# EAGLE design power (EAGLE 6.4)
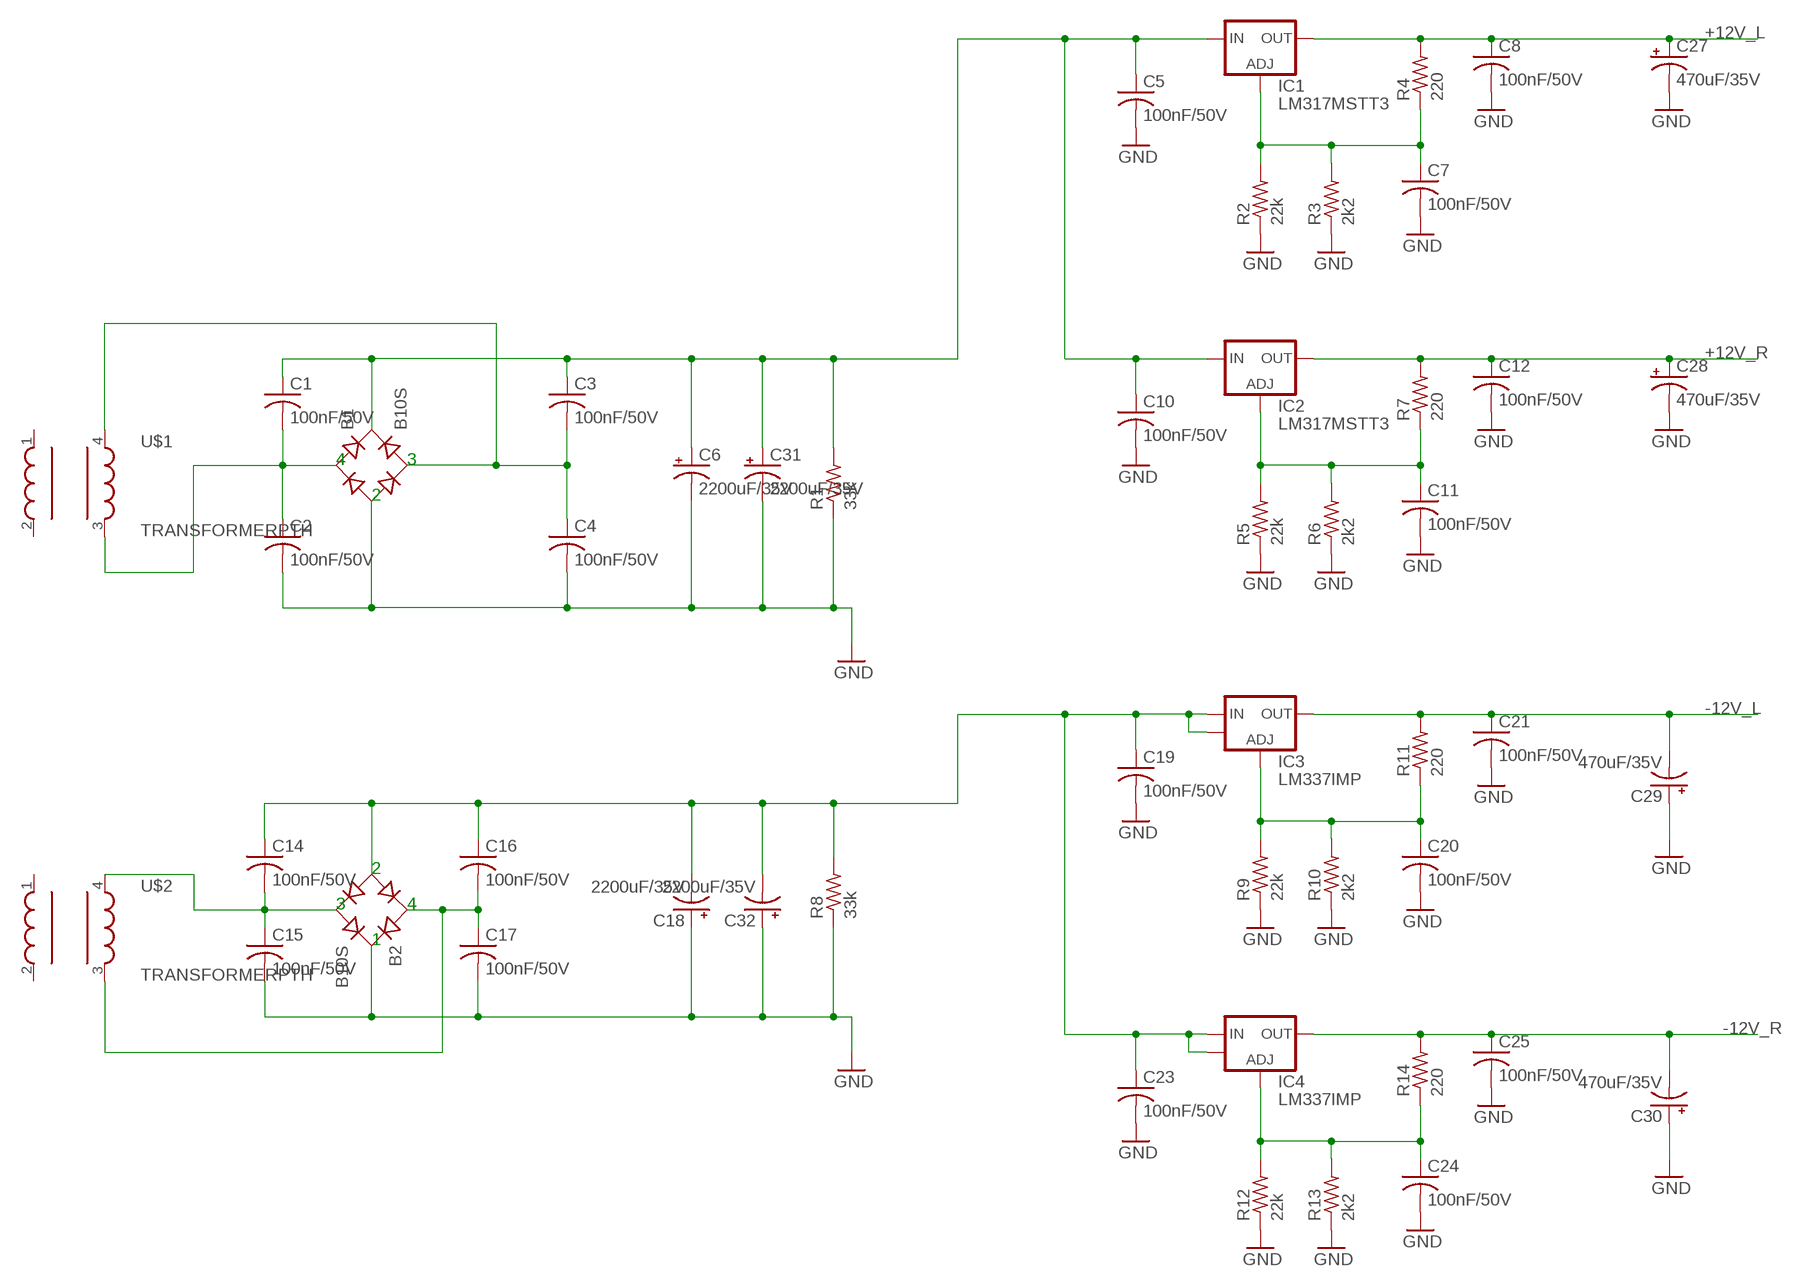
[diagram p0: schematic, sheet 1]

## Parts
B1  B10S  [MBS]
B2  B10S  [MBS]
C1  100nF/50V  C-USC0805  [C0805]
C2  100nF/50V  C-USC0805  [C0805]
C3  100nF/50V  C-USC0805  [C0805]
C4  100nF/50V  C-USC0805  [C0805]
C5  100nF/50V  C-USC0805  [C0805]
C6  2200uF/35V  CPOL-USE5-13  [E5-13]
C7  100nF/50V  C-USC0805  [C0805]
C8  100nF/50V  C-USC0805  [C0805]
C10  100nF/50V  C-USC0805  [C0805]
C11  100nF/50V  C-USC0805  [C0805]
C12  100nF/50V  C-USC0805  [C0805]
C14  100nF/50V  C-USC0805  [C0805]
C15  100nF/50V  C-USC0805  [C0805]
C16  100nF/50V  C-USC0805  [C0805]
C17  100nF/50V  C-USC0805  [C0805]
C18  2200uF/35V  CPOL-USE5-13  [E5-13]
C19  100nF/50V  C-USC0805  [C0805]
C20  100nF/50V  C-USC0805  [C0805]
C21  100nF/50V  C-USC0805  [C0805]
C23  100nF/50V  C-USC0805  [C0805]
C24  100nF/50V  C-USC0805  [C0805]
C25  100nF/50V  C-USC0805  [C0805]
C27  470uF/35V  CPOL-USE5-13  [E5-13]
C28  470uF/35V  CPOL-USE5-13  [E5-13]
C29  470uF/35V  CPOL-USE5-13  [E5-13]
C30  470uF/35V  CPOL-USE5-13  [E5-13]
C31  2200uF/35V  CPOL-USE5-13  [E5-13]
C32  2200uF/35V  CPOL-USE5-13  [E5-13]
IC1  LM317MSTT3  [SOT223]
IC2  LM317MSTT3  [SOT223]
IC3  LM337IMP  [SOT-223]
IC4  LM337IMP  [SOT-223]
R1  33k  R-US_M0805  [M0805]
R2  22k  R-US_M0805  [M0805]
R3  2k2  R-US_M0805  [M0805]
R4  220  R-US_M0805  [M0805]
R5  22k  R-US_M0805  [M0805]
R6  2k2  R-US_M0805  [M0805]
R7  220  R-US_M0805  [M0805]
R8  33k  R-US_M0805  [M0805]
R9  22k  R-US_M0805  [M0805]
R10  2k2  R-US_M0805  [M0805]
R11  220  R-US_M0805  [M0805]
R12  22k  R-US_M0805  [M0805]
R13  2k2  R-US_M0805  [M0805]
R14  220  R-US_M0805  [M0805]
U$1  TRANSFORMERPTH  [TRANSFORMER]
U$2  TRANSFORMERPTH  [TRANSFORMER]

## Nets
+12V_L: C8.1 C27.+ IC1.4(OUT) R4.2
+12V_R: C12.1 C28.+ IC2.4(OUT) R7.2
+VSS_NOREG: B1.+ C1.1 C3.1 C5.1 C6.+ C10.1 C31.+ IC1.3(IN) IC2.3(IN) R1.2
-12V_L: C21.1 C29.- IC3.3(OUT) R11.2
-12V_R: C25.1 C30.- IC4.3(OUT) R14.2
-VSS_NOREG: B2.- C14.1 C16.1 C18.- C19.1 C23.1 C32.- IC3.2(IN) IC3.4 IC4.2(IN) IC4.4 R8.2
GND: B1.- B2.+ C2.2 C4.2 C5.2 C6.- C7.2 C8.2 C10.2 C11.2 C12.2 C15.2 C17.2 C18.+ C19.2 C20.2 C21.2 C23.2 C24.2 C25.2 C27.- C28.- C29.+ C30.+ C31.- C32.+ R1.1 R2.1 R3.1 R5.1 R6.1 R8.1 R9.1 R10.1 R12.1 R13.1
N$1: B1.AC1 C1.2 C2.1 U$1.3
N$2: B1.AC2 C3.2 C4.1 U$1.4
N$4: B2.AC2 C14.2 C15.1 U$2.4
N$7: C7.1 IC1.1(ADJ) R2.2 R3.2 R4.1
N$8: C11.1 IC2.1(ADJ) R5.2 R6.2 R7.1
N$11: B2.AC1 C16.2 C17.1 U$2.3
N$14: C20.1 IC3.1(ADJ) R9.2 R10.2 R11.1
N$17: C24.1 IC4.1(ADJ) R12.2 R13.2 R14.1
Unconnected: U$1.1 U$1.2 U$2.1 U$2.2

## Notes on the sheet
- 4 | 3
- 2
- 2
- 3 | 4
- 1

## Library data of the parts
B1 B2 = rectifier:B*S: Surface Mount Glass Passivated Bridge Rectifiers Source: Comchip Bridge Rectifiers B05S-G_B10S-G.pdf
C1-C5 C7 C8 C10-C12 C14-C17 C19-C21 C23-C25 = rcl:C-US: CAPACITOR, American symbol
C6 C18 C27-C32 = rcl:CPOL-US: POLARIZED CAPACITOR, American symbol
IC1 IC2 = v-reg:LM317?*: 500 mA Adjustable Output Positive Voltage Regulator Source: http://www.onsemi.co.jp .. LM317M-D.PDF
IC3 IC4 = AWJLEagleLib:LM337: LM337 adjustable negative voltage regulator
R1-R14 = rcl:R-US_: RESISTOR, American symbol
U$1 U$2 = SparkFun-PowerIC:TRANSFORMER: Small transformers

## Board
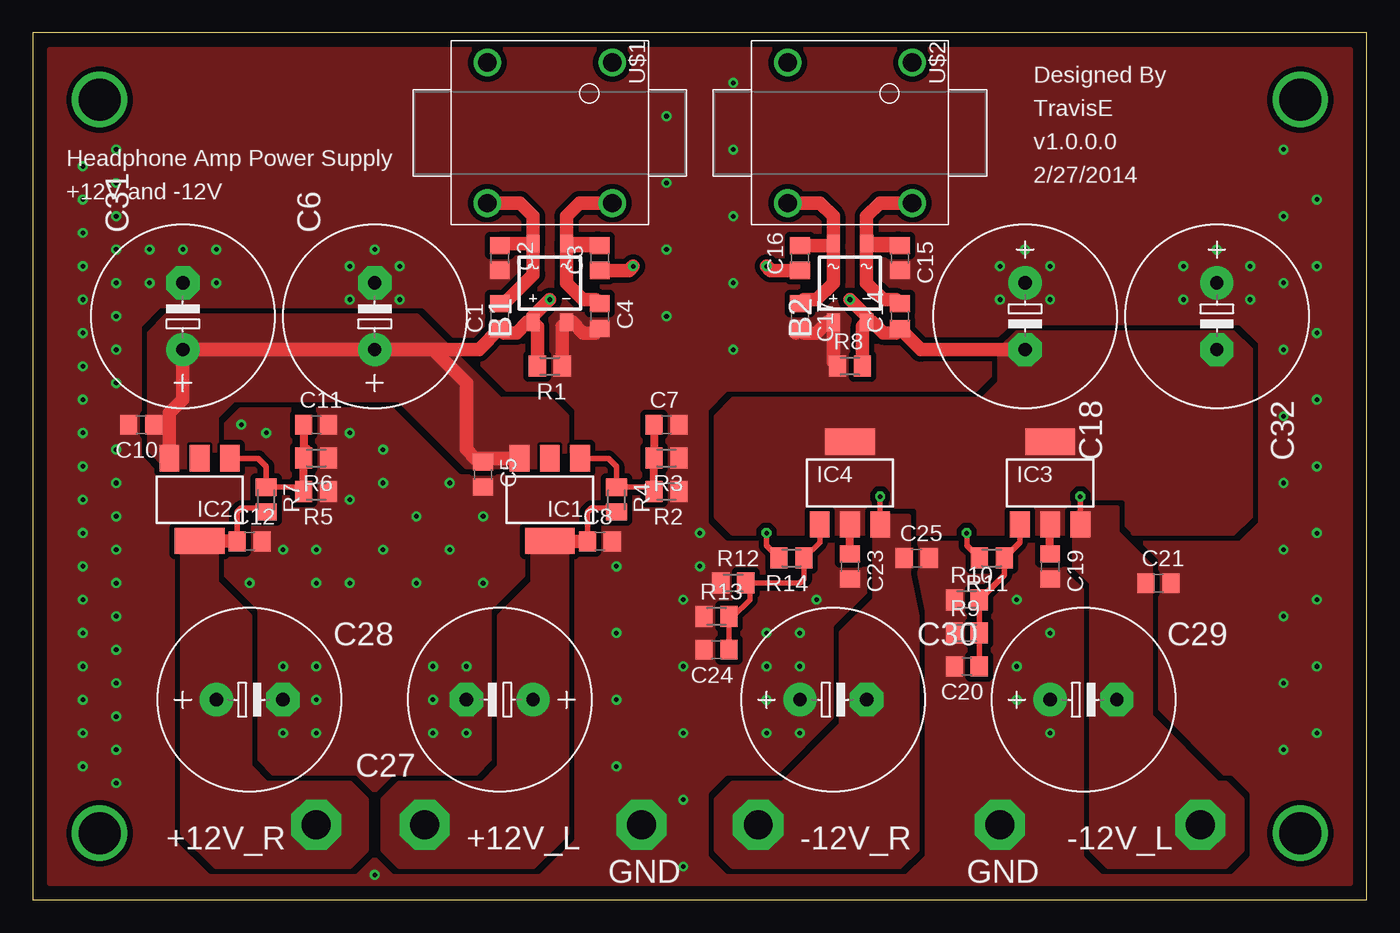
[diagram p1: board, top side]
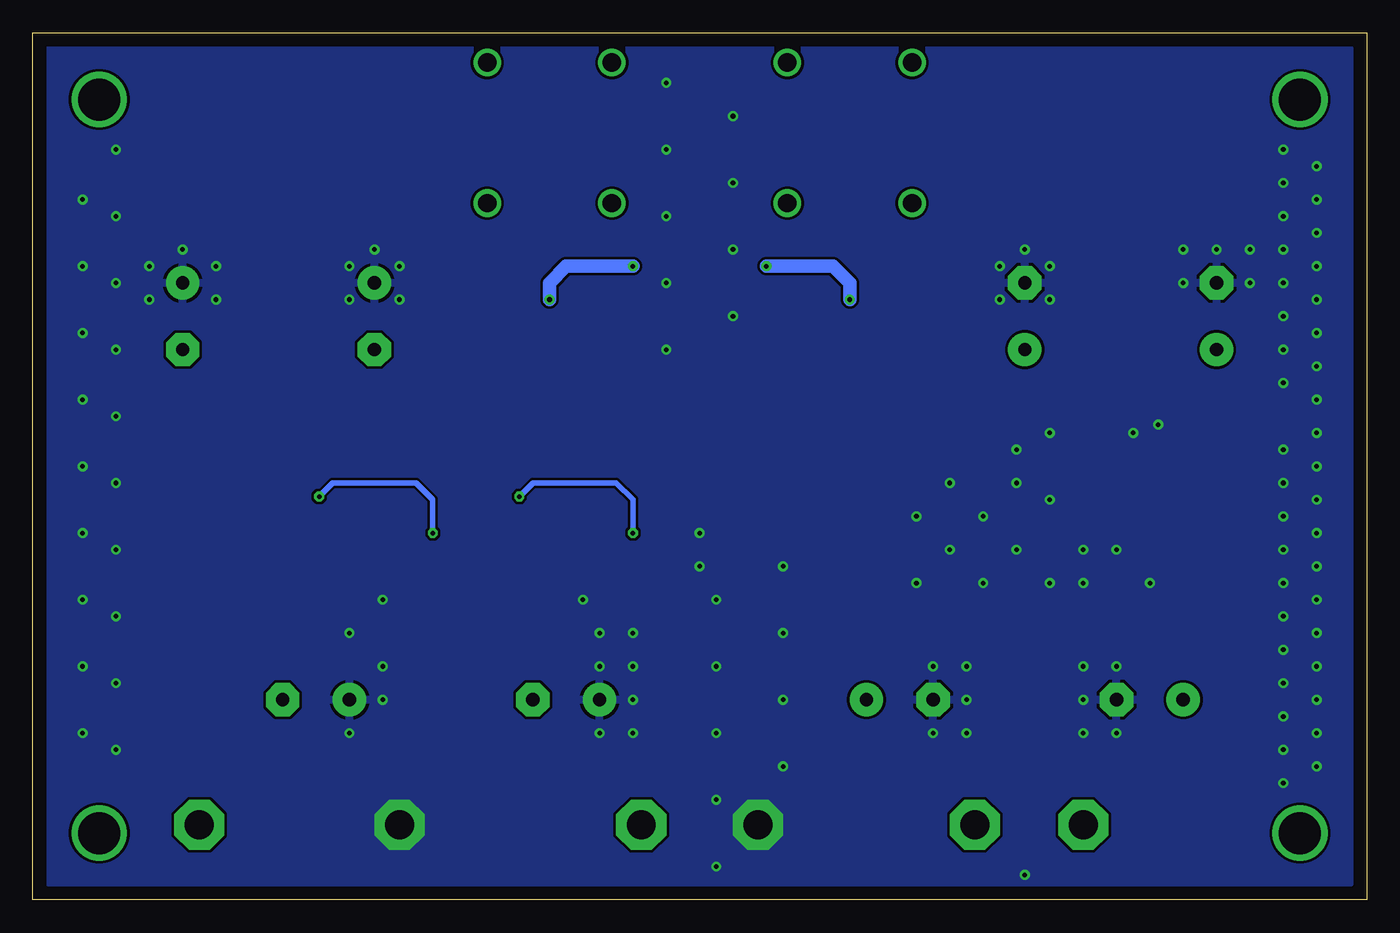
[diagram p2: board, bottom side, seen from below]

Size 101.58 x 66.04 mm. Coordinates in mm from the lower left corner, seen from the top.
Outline: 0,0 101.58,0 101.58,66.04 0,66.04 0,0
Copper layers (1*16): Top 0.035mm / dielectric 1.5mm / Bottom 0.035mm
Design rules "default *": minimum track width 10mil, minimum drill 13mil, track to track 8mil, track to pad 8mil, pad to pad 8mil, via to via 8mil, smd to smd 8mil, copper to edge 40mil, drill to drill 8mil, minimum pad ring 10mil, minimum via ring 8mil, stop-mask expansion 4mil, vias tented up to drill 14mil, thermal gap 10mil

### Footprints (pad centres in the part's own frame; a part is rotated, then mirrored left to right if it is on the bottom)
MBS = smd 1 x 1.3: + -1.27,-3; - 1.27,-3; AC1 -1.27,3; AC2 1.27,3
C0805 = smd 1.3 x 1.5: 1 -0.95,0; 2 0.95,0
E5-13 = drill 1.016 pad 2.54: + -2.54,0 | drill 1.016 pad 2.54 octagon: - 2.54,0
SOT223 = smd 1.5 x 2: 1 -2.3,-3.15; 2 0,-3.15; 3 2.3,-3.15 | smd 3.8 x 2: 4 0,3.15
SOT-223 = smd 1.5 x 2: 1 -2.3,-3.15; 2 0,-3.15; 3 2.3,-3.15 | smd 3.8 x 2: 4 0,3.15
M0805 = smd 1.3 x 1.6: 1 -0.95,0; 2 0.95,0
TRANSFORMER = drill 1.4: 1 -5.35,4.75; 2 -5.35,-4.75; 3 5.35,-4.75; 4 5.35,4.75

### Placement (x,y rotation side)
B1  39.37,46.99 0 top
B2  62.23,46.99 0 top
C1  35.56,44.45 90 top
C2  35.56,48.9 270 top
C3  43.18,48.9 90 top
C4  43.18,44.45 270 top
C5  34.29,32.38 270 top
C6  26.03,44.45 90 top
C7  48.26,36.2 0 top
C8  43.18,27.3 0 top
C10  8.26,36.2 180 top
C11  21.59,36.2 0 top
C12  16.51,27.3 0 top
C14  66.04,44.45 90 top
C15  66.04,48.9 270 top
C16  58.42,48.9 90 top
C17  58.42,44.45 270 top
C18  75.56,44.45 270 top
C19  77.47,25.4 270 top
C20  71.12,17.78 180 top
C21  85.72,24.13 0 top
C23  62.23,25.4 270 top
C24  52.07,19.05 180 top
C25  67.31,26.03 0 top
C27  35.56,15.24 180 top
C28  16.51,15.24 0 top
C29  80.01,15.24 0 top
C30  60.96,15.24 0 top
C31  11.43,44.45 90 top
C32  90.17,44.45 270 top
IC1  39.37,30.48 180 top
IC2  12.7,30.48 180 top
IC3  77.47,31.75 0 top
IC4  62.23,31.75 0 top
R1  39.37,40.64 180 top
R2  48.26,31.12 180 top
R3  48.26,33.65 180 top
R4  44.45,30.48 270 top
R5  21.59,31.12 180 top
R6  21.59,33.65 180 top
R7  17.78,30.48 270 top
R8  62.23,40.64 0 top
R9  71.12,20.32 0 top
R10  71.12,22.86 0 top
R11  73.03,26.03 180 top
R12  53.34,24.13 0 top
R13  52.07,21.59 0 top
R14  57.79,26.03 180 top
U$1  39.37,58.42 270 top
U$2  62.23,58.42 270 top

### Tracks (layer width: path | path; a pad name or v marks a point on that pad's centre or on a via)
+12V_L  (via drill 2.2 pad 3.81)
  Top 0.406: C8.1 42.23,29.53 42.54,29.84 44.13,29.84 R4.2
  Top 1.016: C8.1 39.4,27.3
  other vias: 29.84,5.71
  pour Top (no thermals): 38.1,27.94 38.1,24.13 35.56,21.59 35.56,10.16 34.29,8.89 27.94,8.89 26.67,7.62 26.67,3.81 27.94,2.54 38.1,2.54 40.64,5.08 40.64,27.94
+12V_R  (via drill 2.2 pad 3.81)
  Top 0.406: C12.1 15.56,29.53 15.88,29.84 17.46,29.84 R7.2
  Top 1.016: IC2.4 15.53,27.33 C12.1
  other vias: 21.59,5.71
  pour Top (no thermals): 11.43,27.94 11.43,5.08 13.97,2.54 24.13,2.54 25.4,3.81 25.4,7.62 24.13,8.89 17.78,8.89 16.51,10.16 16.51,21.59 13.97,24.13 13.97,27.94
+VSS_NOREG  (via drill 0.35)
  Top 1.016: B1.+ 37.64,43.99 36.83,43.18 35.88,43.18 C1.1 33.97,41.91 30.48,41.91 | C3.1 45.4,47.95 v45.72,48.26 | B1.+ 38.1,44.45 v39.37,45.72 | R1.2 38.42,43.67 B1.+ | 30.48,41.91 C6.+ C31.+ 11.43,38.1 10.4,37.07 IC2.3 | IC1.3 33.68,33.63 33.02,34.29 33.02,39.37 30.48,41.91
  Bottom 1.016: v39.37,45.72 39.37,46.99 40.64,48.26 v45.72,48.26
  pour Top (no thermals): 29.21,44.45 10.16,44.45 8.89,43.18 8.89,34.29 10.16,33.02 12.7,33.02 13.97,34.29 13.97,36.83 15.24,38.1 27.94,38.1 33.02,33.02 39.37,33.02 40.64,34.29 40.64,36.83 39.37,38.1 35.56,38.1
-12V_L  (via drill 0.35, 2.2 pad 3.81)
  Top 0.406: IC3.3 v79.77,30.72 | R11.2 71.12,26.99 v71.12,27.94
  Bottom 0.406: v79.77,30.72 78.74,31.75 72.39,31.75 71.12,30.48 v71.12,27.94
  other vias: 88.9,5.71
  pour Top (no thermals): 79.38,29.21 79.38,25.4 80.65,24.13 80.65,3.81 81.91,2.54 90.81,2.54 92.07,3.81 92.07,7.62 90.81,8.89 90.17,8.89 85.09,13.97 85.09,25.4 82.55,27.94 82.55,29.84 80.01,29.84
-12V_R  (via drill 0.35, 2.2 pad 3.81)
  Top 0.406: IC4.3 v64.53,30.72 | R14.2 55.88,26.99 v55.88,27.94
  Bottom 0.406: v64.53,30.72 63.5,31.75 57.15,31.75 55.88,30.48 v55.88,27.94
  other vias: 55.24,5.71
  pour Top (no thermals): 64.13,29.21 64.13,22.86 61.6,20.32 61.6,13.33 57.15,8.89 53.34,8.89 52.07,7.62 52.07,3.81 53.34,2.54 66.04,2.54 67.31,3.81 67.31,21.59 66.68,24.76 66.68,29.21
-VSS_NOREG  (via drill 0.35)
  Top 0.61: C23.1 IC4.2 | C19.1 IC3.2
  Top 1.016: C16.1 56.2,47.95 v55.88,48.26 | v62.23,45.72 63.5,44.45 B2.- | B2.- 63.96,43.99 64.77,43.18 65.72,43.18 C14.1 67.63,41.91 C18.- | R8.2 63.18,43.67 B2.-
  Bottom 1.016: v55.88,48.26 60.96,48.26 62.23,46.99 v62.23,45.72
  pour Top (isolate 0.406, rank 5, no thermals): 74.93,43.18 73.66,41.91 73.66,39.37 72.39,38.1 53.34,38.1 52.07,36.83 52.07,29.21 53.34,27.94 85.09,27.94 86.36,29.21 86.36,36.83 85.09,38.1 78.74,38.1 77.47,39.37 77.47,41.91 76.2,43.18
  pour Top (no thermals): 76.2,43.18 91.44,43.18 92.71,41.91 92.71,29.21 91.44,27.94 83.82,27.94 83.82,36.83 77.47,36.83 76.2,38.1
GND  (via drill 0.35, 2.2 pad 3.81)
  Top 1.016: C4.2 42.86,43.18 41.91,43.18 41.1,43.99 B1.- 40.32,43.67 R1.1 | 58.1,43.18 C17.2 58.74,43.18 59.69,43.18 60.5,43.99 B2.+ 60.96,40.96 R8.1
  other vias: 17.78,35.56 15.88,36.2 26.03,1.9 46.35,5.71 73.66,5.71 6.35,57.15 6.35,54.61 3.81,55.88 3.81,53.34 6.35,52.07 3.81,50.8 13.97,46.99 13.97,49.53 11.43,49.53 8.89,49.53 6.35,49.53 6.35,46.99 3.81,48.26 3.81,45.72 8.89,46.99 6.35,44.45 6.35,41.91 6.35,39.37 3.81,43.18 3.81,40.64 3.81,38.1 3.81,35.56 6.35,34.29 6.35,31.75 3.81,33.02 3.81,30.48 6.35,29.21 6.35,26.67 3.81,27.94 3.81,25.4 6.35,24.13 6.35,21.59 3.81,22.86 3.81,20.32 6.35,19.05 3.81,17.78 6.35,16.51 6.35,13.97 3.81,15.24 3.81,12.7 6.35,11.43 3.81,10.16 6.35,8.89 26.03,49.53 27.94,48.26 27.94,45.72 24.13,48.26 24.13,45.72 24.13,35.56 26.67,34.29 26.67,31.75 31.75,31.75 34.29,29.21 34.29,24.13 31.75,26.67 29.21,29.21 29.21,24.13 26.67,26.67 24.13,30.48 24.13,24.13 21.59,24.13 21.59,26.67 19.05,26.67 16.51,24.13 33.02,12.7 30.48,12.7 30.48,15.24 30.48,17.78 33.02,17.78 19.05,12.7 21.59,12.7 21.59,15.24 21.59,17.78 19.05,17.78 49.53,2.54 49.53,7.62 44.45,10.16 49.53,12.7 44.45,15.24 49.53,17.78 55.88,12.7 58.42,12.7 55.88,15.24 55.88,17.78 58.42,17.78 58.42,20.32 59.69,22.86 55.88,20.32 44.45,20.32 49.53,22.86 44.45,25.4 50.8,25.4 50.8,27.94 77.47,12.7 74.93,15.24 74.93,17.78 77.47,20.32 74.93,22.86 95.25,11.43 97.79,12.7 95.25,16.51 97.79,17.78 95.25,21.59 97.79,22.86 97.79,27.94 95.25,26.67 95.25,31.75 97.79,33.02 95.25,36.83 97.79,38.1 95.25,41.91 97.79,43.18 97.79,48.26 95.25,52.07 95.25,46.99 92.71,45.72 87.63,45.72 90.17,49.53 92.71,48.26 87.63,48.26 77.47,45.72 77.47,48.26 75.56,49.53 73.66,48.26 73.66,45.72 97.79,53.34 95.25,57.15 53.34,62.23 48.26,59.69 53.34,57.15 53.34,52.07 48.26,54.61 48.26,49.53 53.34,46.99 53.34,41.91 48.26,44.45
  pour Top (isolate 0.406, rank 6, no thermals): 1.27,64.77 100.33,64.77 100.33,1.27 1.27,1.27
  pour Bottom: 1.27,64.77 100.33,64.77 100.33,1.27 1.27,1.27
N$1
  Top 1.016: U$1.3 37.1,53.07 38.1,52.07 B1.AC1 | B1.AC1 35.71,49.99 C2.1 | C1.2 35.87,45.4 38.1,47.62 B1.AC1
N$2
  Top 1.016: U$1.4 41.64,53.07 40.64,52.07 B1.AC2 43.04,49.99 C3.2 40.96,49.84 40.64,49.53 40.64,46.99 41.91,45.72 42.86,45.72 C4.1
N$3  (via drill 3.2 pad 3.81)
  other vias: 5.08,60.96
N$4
  Top 1.016: U$2.4 64.5,53.07 63.5,52.07 B2.AC2 65.9,49.99 C15.1 63.82,49.84 63.5,49.53 63.5,46.99 64.77,45.72 65.72,45.72 C14.2
N$5  (via drill 3.2 pad 3.81)
  other vias: 96.52,60.96
N$6  (via drill 3.2 pad 3.81)
  other vias: 96.52,5.08
N$7
  Top 0.406: IC1.1 43.84,33.63 44.45,33.02 R4.1 46.99,31.43 R2.2
  Top 0.61: R2.2 R3.2 C7.1
N$8
  Top 0.406: R5.2 20.32,31.43 R7.1 17.78,33.02 17.17,33.63 IC2.1 | R6.2 20.64,33.98 20.95,34.29 20.95,33.97 R6.2
  Top 0.61: R5.2 R6.2 | C11.1 20.64,34.6 20.95,34.29
N$9  (via drill 3.2 pad 3.81)
  other vias: 5.08,5.08
N$11
  Top 1.016: U$2.3 59.96,53.07 60.96,52.07 B2.AC1 60.82,49.84 C16.2 60.65,49.84 60.96,49.53 60.96,46.99 59.69,45.72 58.74,45.72 C17.1
N$14
  Top 0.406: IC3.1 75.17,27.23 R11.1 73.97,24.76 R10.2 R9.2 C20.1
N$17
  Top 0.406: IC4.1 59.93,27.23 R14.1 58.73,24.45 58.42,24.13 R12.2 54.61,23.81 54.61,22.86 53.34,21.59 R13.2 C24.1

### Text on the board
tPlace: Designed By | TravisE | v1.0.0.0 | Headphone Amp Power Supply | 2/27/2014 | +12V and -12V | +12V_R | +12V_L | -12V_R | -12V_L | GND | GND